# EAGLE design c12880ma (EAGLE 9.6.2)
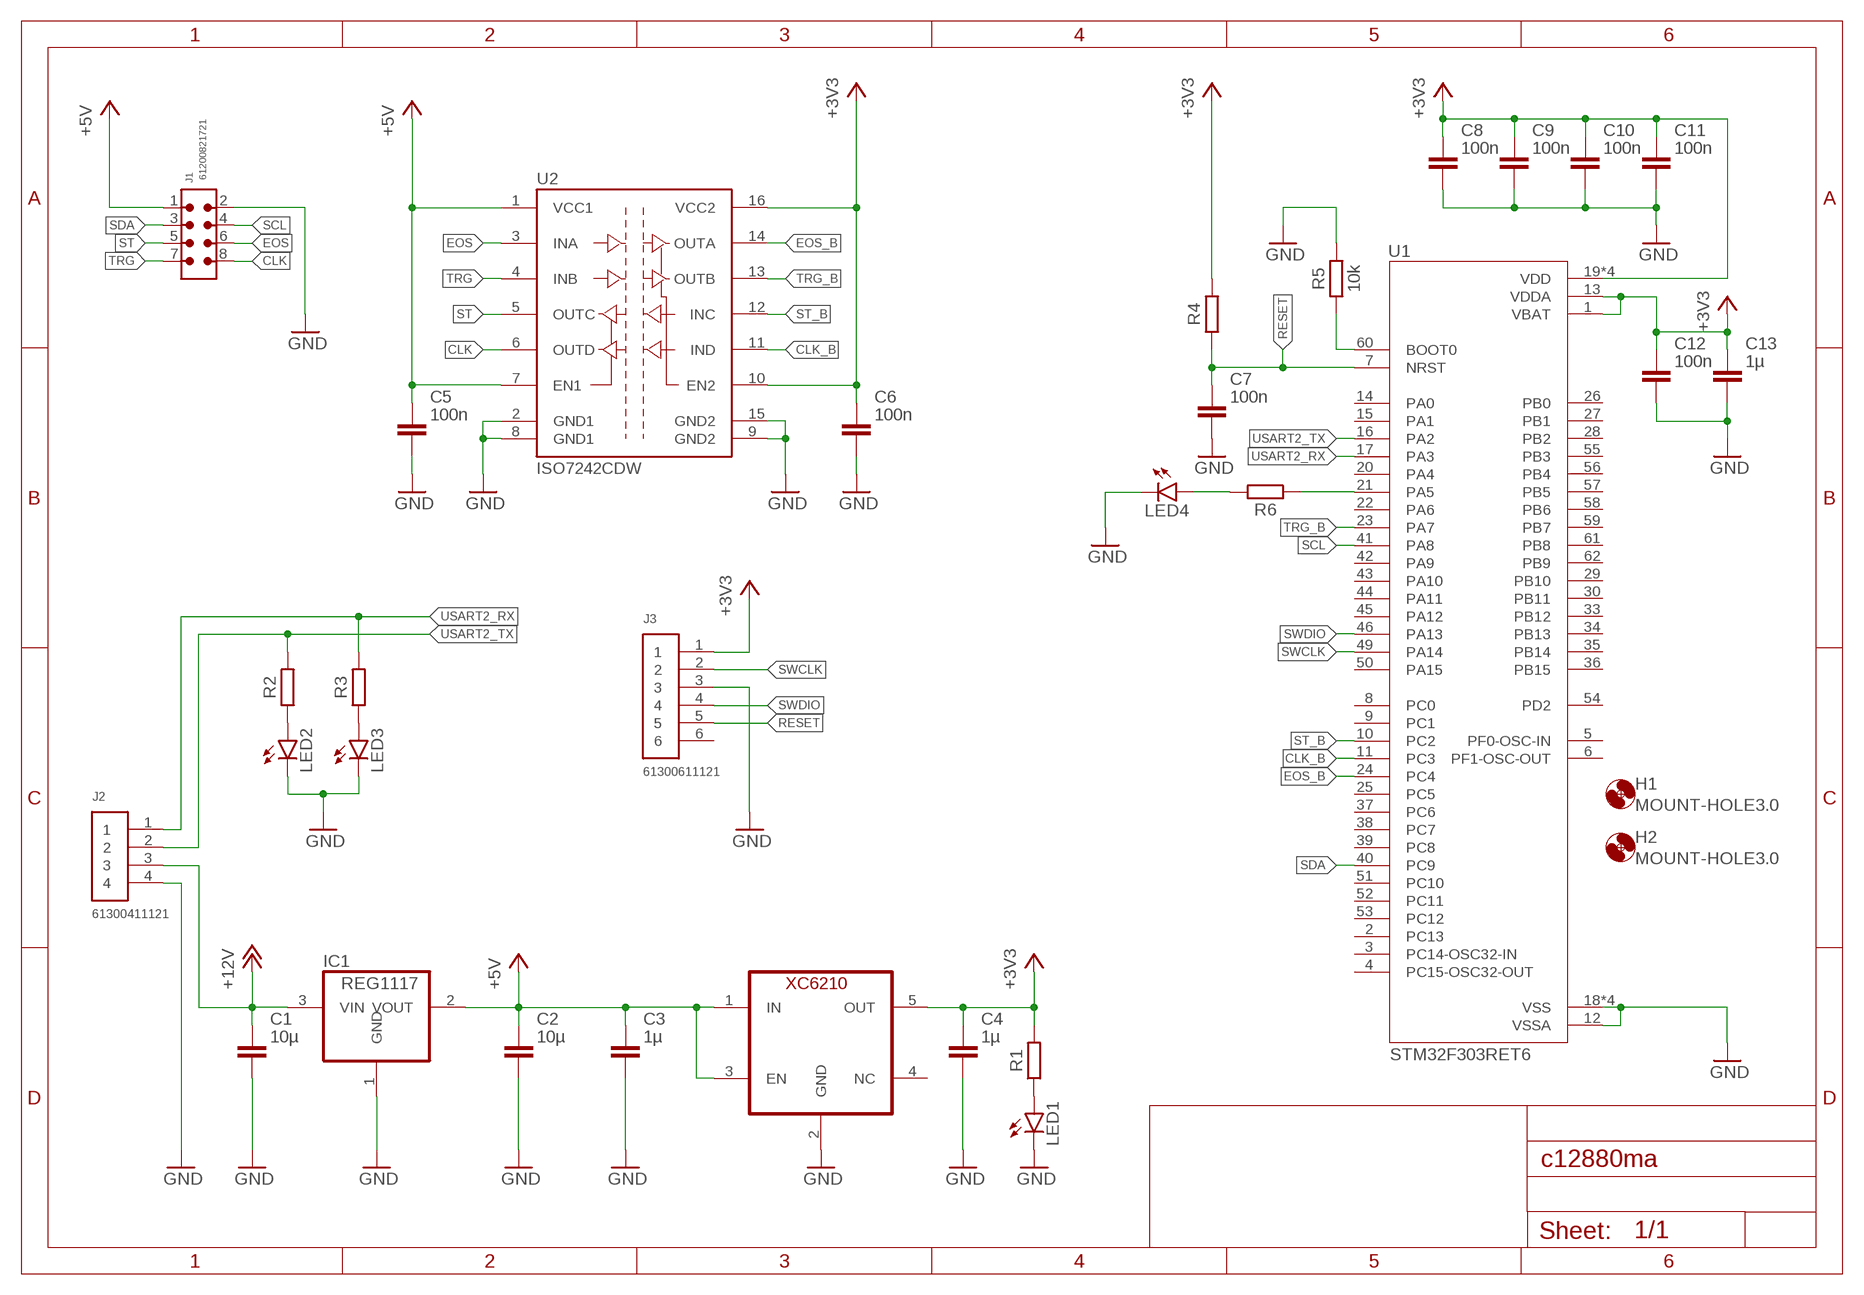
[diagram p0: schematic, sheet 1]

## Parts
C1  10µ  C_CHIP-0603(1608-METRIC)  [CAPC1608X85]
C2  10µ  C_CHIP-0603(1608-METRIC)  [CAPC1608X85]
C3  1µ  C_CHIP-0603(1608-METRIC)  [CAPC1608X85]
C4  1µ  C_CHIP-0603(1608-METRIC)  [CAPC1608X85]
C5  100n  C_CHIP-0603(1608-METRIC)  [CAPC1608X85]
C6  100n  C_CHIP-0603(1608-METRIC)  [CAPC1608X85]
C7  100n  C_CHIP-0603(1608-METRIC)  [CAPC1608X85]
C8  100n  C_CHIP-0603(1608-METRIC)  [CAPC1608X85]
C9  100n  C_CHIP-0603(1608-METRIC)  [CAPC1608X85]
C10  100n  C_CHIP-0603(1608-METRIC)  [CAPC1608X85]
C11  100n  C_CHIP-0603(1608-METRIC)  [CAPC1608X85]
C12  100n  C_CHIP-0603(1608-METRIC)  [CAPC1608X85]
C13  1µ  C_CHIP-0603(1608-METRIC)  [CAPC1608X85]
H1  MOUNT-HOLE3.0  [3,0]
H2  MOUNT-HOLE3.0  [3,0]
IC1  REG1117  [SOT223]
J1  61200821721  6120XX21721_61200821721  [61200821721]
J2  61300411121  [61300411121]
J3  61300611121  [61300611121]
LED1  LEDCHIP-LED0603  [CHIP-LED0603]
LED2  LEDCHIP-LED0603  [CHIP-LED0603]
LED3  LEDCHIP-LED0603  [CHIP-LED0603]
LED4  LEDCHIP-LED0603  [CHIP-LED0603]
R1  R_CHIP-0603(1608-METRIC)  [RESC1608X60]
R2  R_CHIP-0603(1608-METRIC)  [RESC1608X60]
R3  R_CHIP-0603(1608-METRIC)  [RESC1608X60]
R4  R_CHIP-0603(1608-METRIC)  [RESC1608X60]
R5  10k  R_CHIP-0603(1608-METRIC)  [RESC1608X60]
R6  R_CHIP-0603(1608-METRIC)  [RESC1608X60]
U1  STM32F303RET6  [QFP50P1200X1200X160-64N]
U2  ISO7242CDW  [SO-16DW]
U$1  XC6210  [SOT23-5]

## Nets
+3V3: C4.1 C6.1 C8.1 C9.1 C10.1 C11.1 C12.1 C13.1 J3.1 R1.2 R4.2 U1.1(VBAT) U1.13(VDDA) U1.19(VDD) U1.32(VDD) U1.48(VDD) U1.64(VDD) U2.10(EN2) U2.16(VCC2) U$1.5(OUT)
+5V: C2.1 C3.1 C5.1 IC1.2(VOUT) J1.1 U2.1(VCC1) U2.7(EN1) U$1.1(IN) U$1.3(EN)
+12V: C1.1 IC1.3(VIN) J2.3
CLK: J1.8 U2.6(OUTD)
CLK_B: U1.11(PC3) U2.11(IND)
EOS: J1.6 U2.3(INA)
EOS_B: U1.24(PC4) U2.14(OUTA)
GND: C1.2 C2.2 C3.2 C4.2 C5.2 C6.2 C7.2 C8.2 C9.2 C10.2 C11.2 C12.2 C13.2 IC1.1(GND) J1.2 J2.4 J3.3 LED1.C LED2.C LED3.C LED4.C R5.2 U1.12(VSSA) U1.18(VSS) U1.31(VSS) U1.47(VSS) U1.63(VSS) U2.2(GND1) U2.8(GND1) U2.9(GND2) U2.15(GND2) U$1.2(GND)
N$3: LED2.A R2.1
N$4: LED1.A R1.1
N$5: LED3.A R3.1
N$8: R5.1 U1.60(BOOT0)
N$9: R6.1 U1.21(PA5)
N$10: LED4.A R6.2
RESET: C7.1 J3.5 R4.1 U1.7(NRST)
SCL: J1.4 U1.41(PA8)
SDA: J1.3 U1.40(PC9)
ST: J1.5 U2.5(OUTC)
ST_B: U1.10(PC2) U2.12(INC)
SWCLK: J3.2 U1.49(PA14)
SWDIO: J3.4 U1.46(PA13)
TRG: J1.7 U2.4(INB)
TRG_B: U1.23(PA7) U2.13(OUTB)
USART2_RX: J2.1 R3.2 U1.17(PA3)
USART2_TX: J2.2 R2.2 U1.16(PA2)
Unconnected: J3.6 U1.2(PC13) U1.3(PC14-OSC32-IN) U1.4(PC15-OSC32-OUT) U1.5(PF0-OSC-IN) U1.6(PF1-OSC-OUT) U1.8(PC0) U1.9(PC1) U1.14(PA0) U1.15(PA1) U1.20(PA4) U1.22(PA6) U1.25(PC5) U1.26(PB0) U1.27(PB1) U1.28(PB2) U1.29(PB10) U1.30(PB11) U1.33(PB12) U1.34(PB13) U1.35(PB14) U1.36(PB15) U1.37(PC6) U1.38(PC7) U1.39(PC8) U1.42(PA9) U1.43(PA10) U1.44(PA11) U1.45(PA12) U1.50(PA15) U1.51(PC10) U1.52(PC11) U1.53(PC12) U1.54(PD2) U1.55(PB3) U1.56(PB4) U1.57(PB5) U1.58(PB6) U1.59(PB7) U1.61(PB8) U1.62(PB9) U$1.4(NC)

## Library data of the parts
C1-C13 = Capacitor:C: Capacitor - Generic; CATEGORY: Capacitor
H1 H2 = holes:MOUNT-HOLE: MOUNTING HOLE with drill center marker
IC1 = burr-brown:REG1117: 800mA and 1A Low Dropout (LDO) Positive Regulator 1.8V, 2.5V, 2.85V, 3.3V, 5V, and Adj; MPN: REG1117; OC_FARNELL: 1097566; OC_NEWARK: 14P6981
J1 = Wurth_Connectors_WR-BHD:6120XX21721_61200821721: WR-BHD 2.54 mm Male Angled Box Header KIND PROPERTIES: Pitch 2.54 mm Gender:Male MATERIAL PROPERTIES: Insulator Material:PBT Insulator Flammability Rating UL94 V-0 Insulator Color:Black Contact Material :Copper Alloy Contact Plating :Gold Contact Type: Stamped GENERAL INFORMATION: Operating Temperature:-40 °C up to +125 °C Compliance:RoHS Working Voltage: 250 V (AC) Withstanding Voltage:500 V (AC) Contact Resistance: 20 mΩ Insulation Resistance:1000 MΩ CERTIFICATION: UL Approval:E323964 PACKAGING PROPERTIES Packaging :Tray <https://www.we-online.de/katalog/media/o32888v209%20Family_WR-BHD_6120xx21721.jpg> Details see: https://www.we-online.de/katalog/en/em/BHD_2_54_MALE_ANGLED_BOX_HEADER_6120XX21721 Updated by Yingchun,Shan 2019-10-29 2019 (C) Würth Elektronik; CONTACT-RESISTANCE: 20mOhm; DATASHEET-URL: https://www.we-online.com/redexpert/spec/61200821721?ae; GENDER: Male; IR: 3A; LENGTH: 17.82mm; MOUNT: THT; PACKAGING: Tray; PART-NUMBER: 61200821721; PINS: 8; PITCH: 2.54mm; TYPE: Angled; WORKING-VOLTAGE: 250V(AC)
J2 = Headers:61300411121: CONN HEADER VERT 4POS 2.54MM Manufacturer's datasheet <https://katalog.we-online.de/em/datasheet/6130xx11121.pdf>; CREATED_BY: PCBLayout.com; DIGI_KEY_PART_NUMBER: 732-5317-ND; MANUFACTURER: Wurth Electronics Inc.; MPN: 61300411121
J3 = Headers:61300611121: CONN HEADER VERT 6POS 2.54MM Manufacturer's datasheet <https://katalog.we-online.de/em/datasheet/6130xx11121.pdf>; CREATED_BY: PCBLayout.com; DIGI_KEY_PART_NUMBER: 732-5319-ND; MANUFACTURER: Wurth Electronics Inc.; MPN: 61300611121
LED1-LED4 = led:LED: LED OSRAM: - CHIPLED LG R971, LG N971, LY N971, LG Q971, LY Q971, LO R971, LY R971 LH N974, LH R974 LS Q976, LO Q976, LY Q976 LO Q996 - Hyper CHIPLED LW Q18S LB Q993, LB Q99A, LB R99A - SideLED LS A670, LO A670, LY A670, LG A670, LP A670 LB A673, LV A673, LT A673, LW A673 LH A674 LY A675 LS A676, LA A676, LO A676, LY A676, LW A676 LS A679, LY A679, LG A679 - Hyper Micro SIDELED® LS Y876, LA Y876, LO Y876, LY Y876 LT Y87S - SmartLED LW L88C, LW L88S LB L89C, LB L89S, LG L890 LS L89K, LO L89K, LY L89K LS L896, LA L896, LO L896, LY L896 - TOPLED LS T670, LO T670, LY T670, LG T670, LP T670 LSG T670, LSP T670, LSY T670, LOP T670, LYG T670 LG T671, LOG T671, LSG T671 LB T673, LV T673, LT T673, LW T673 LH T674 LS T676, LA T676, LO T676, LY T676, LB T676, LH T676, LSB T676, LW T676 LB T67C, LV T67C, LT T67C, LS T67K, LO T67K, LY T67K, LW E67C LS E67B, LA E67B, LO E67B, LY E67B, LB E67C, LV E67C, LT E67C LW T67C LS T679, LY T679, LG T679 LS T770, LO T770, LY T770, LG T770, LP T770 LB T773, LV T773, LT T773, LW T773 LH T774 LS E675, LA E675, LY E675, LS T675 LS T776, LA T776, LO T776, LY T776, LB T776 LHGB T686 LT T68C, LB T68C - Hyper Mini TOPLED® LB M676 - Mini TOPLED Santana® LG M470 LS M47K, LO M47K, LY M47K Source: http://www.osram.convergy.de LUXEON: - LUMILED® LXK2-PW12-R00, LXK2-PW12-S00, LXK2-PW14-U00, LXK2-PW14-V00 LXK2-PM12-R00, LXK2-PM12-S00, LXK2-PM14-U00 LXK2-PE12-Q00, LXK2-PE12-R00, LXK2-PE12-S00, LXK2-PE14-T00, LXK2-PE14-U00 LXK2-PB12-K00, LXK2-PB12-L00, LXK2-PB12-M00, LXK2-PB14-N00, LXK2-PB14-P00, LXK2-PB14-Q00 LXK2-PR12-L00, LXK2-PR12-M00, LXK2-PR14-Q00, LXK2-PR14-R00 LXK2-PD12-Q00, LXK2-PD12-R00, LXK2-PD12-S00 LXK2-PH12-R00, LXK2-PH12-S00 LXK2-PL12-P00, LXK2-PL12-Q00, LXK2-PL12-R00 Source: www.luxeon.com KINGBRIGHT: KA-3528ASYC Source: www.kingbright.com
R1-R6 = Resistor:R: Resistor Fixed - Generic; CATEGORY: Resistor; SUB-CATEGORY: Fixed
U1 = STM32F303RET6:STM32F303RET6: MCU 32-Bit STM32 ARM Cortex M4 RISC 512KB Flash 2.5V/3.3V 64-Pin LQFP Tray Check availability <https://pricing.snapeda.com/parts/STM32F303RET6/STMicroelectronics/view-part?ref=eda>; AVAILABILITY: In Stock; DESCRIPTION: ARM® Cortex®-M4 STM32F3 Microcontroller IC 32-Bit Single-Core 72MHz 512KB (512K x 8) FLASH 64-LQFP (10x10); MF: STMicroelectronics; MP: STM32F303RET6; PACKAGE: LQFP-64 STMicroelectronics; PRICE: None; PURCHASE-URL: https://pricing.snapeda.com/search/part/STM32F303RET6/?ref=eda
U2 = _hhn_AMC1100_ISO7240_ADS130:ISO7242*: ISO7242 High Speed Quad Digital Isolators Package: SOIC-16 300mil (TI-postfix "DW") ISO7240x: 4-channel with enable ISO7240xF: 4-channel with disable and fault-control ISO7241: 3+1 channel with enables ISO7242: 2+2 channel with enables x = '_' (Generic); 'C' (TTL input thresholds); 'M' (CMOS input thresholds) Author: Dipl.-Ing. FH Rainer Bayer Hochschule Heilbronn: http://www.hochschule-heilbronn.de/rainer.bayer <http://www.hs-heilbronn.de/rainer.bayer> – rainer.bayer@hs-heilbronn.de Ingenieurbüro ing-rb: http://www.ing-rb.de/ – eagle@ing-rb.de Dozent dozent-rb: http://www.dozent-rb.de/ – eagle@dozent-rb.de
U$1 = Components:XC6210

## Board
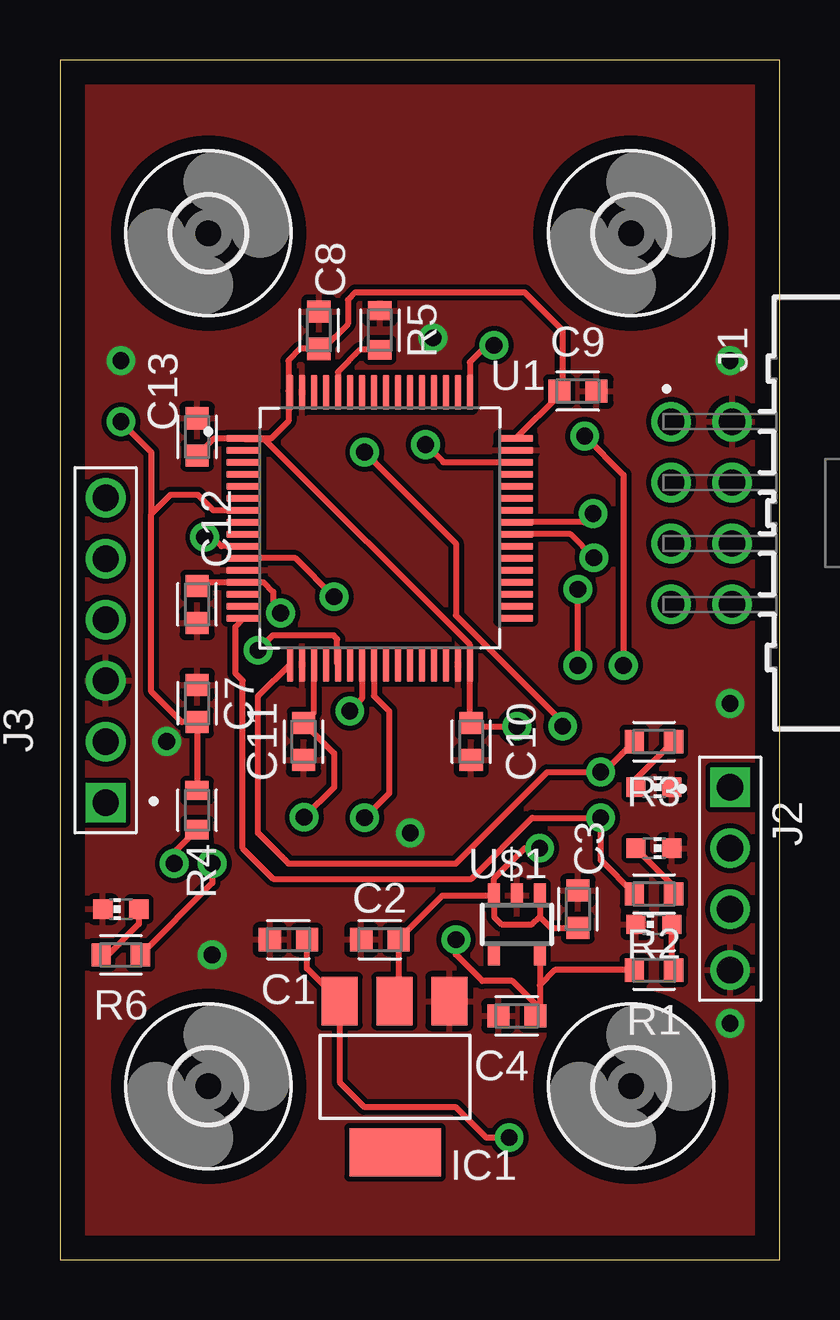
[diagram p1: board, top side]
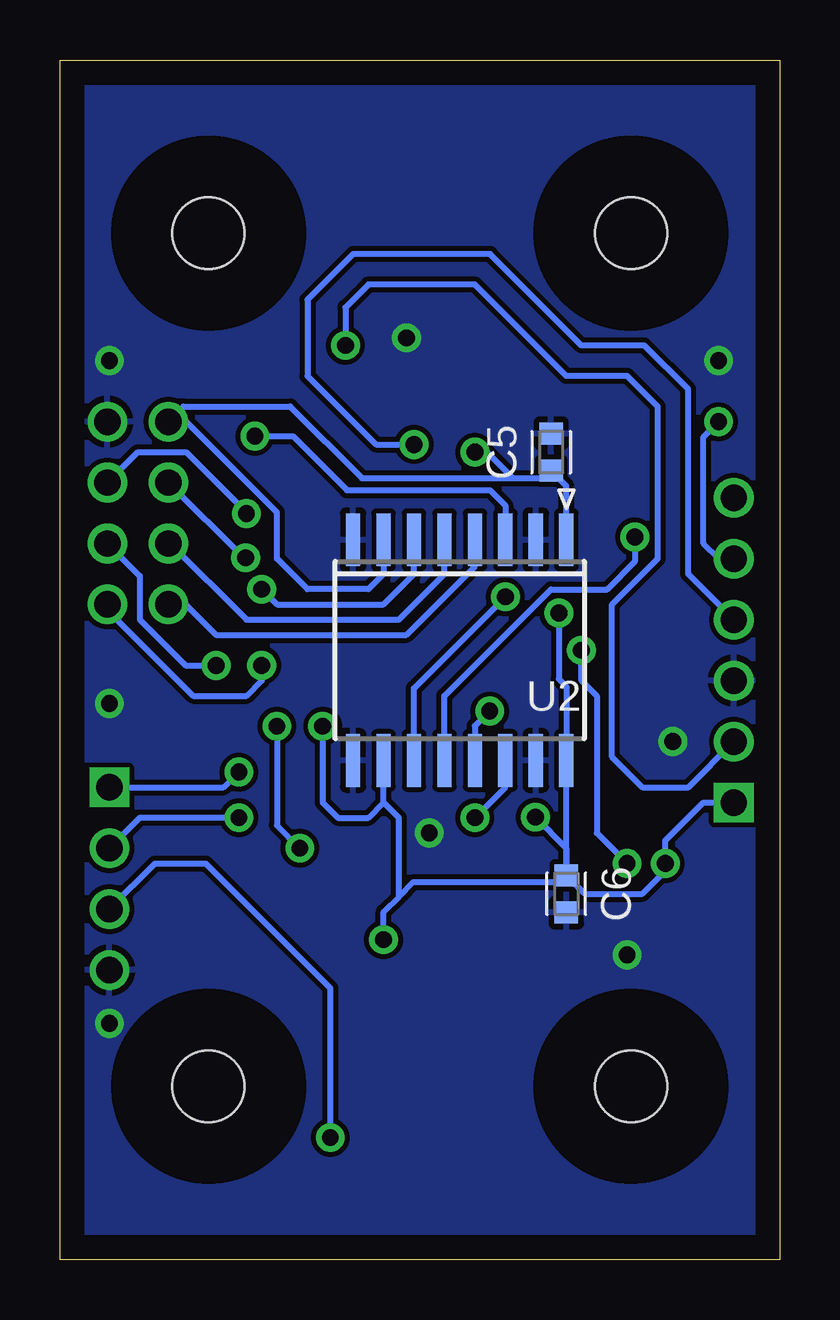
[diagram p2: board, bottom side, seen from below]

Size 30 x 50 mm. Coordinates in mm from the lower left corner, seen from the top.
Outline: 0,0 30,0 30,50 0,50 0,0
Copper layers (1*16): Top 0.035mm / dielectric 1.5mm / Bottom 0.035mm
Design rules "default *": minimum track width 6mil, minimum drill 0.35mm, track to track 8mil, track to pad 8mil, pad to pad 8mil, via to via 8mil, smd to smd 8mil, copper to edge 40mil, drill to drill 6mil, minimum pad ring 10mil, minimum via ring 8mil, stop-mask expansion 4mil, vias tented up to drill 0mil, thermal gap 10mil

### Footprints (pad centres in the part's own frame; a part is rotated, then mirrored left to right if it is on the bottom)
CAPC1608X85 = smd 0.921 x 0.97: 1 -0.775,0; 2 0.775,0
3,0 = hole 3: 0,0
SOT223 = smd 1.499 x 2.007: 1 -2.261,-3.15; 2 0.025,-3.15; 3 2.311,-3.15 | smd 3.81 x 2.007: 4 0,3.15
61200821721 = drill 1.1: 1 3.81,8.805; 2 3.81,6.265; 3 1.27,8.805; 4 1.27,6.265; 5 -1.27,8.805; 6 -1.27,6.265; 7 -3.81,8.805; 8 -3.81,6.265
61300411121 = drill 1.1 square: 1 -3.81,0 | drill 1.1: 2 -1.27,0; 3 1.27,0; 4 3.81,0
61300611121 = drill 1.1 square: 1 -6.35,0 | drill 1.1: 2 -3.81,0; 3 -1.27,0; 4 1.27,0; 5 3.81,0; 6 6.35,0
CHIP-LED0603 = smd 0.8 x 0.8: A 0,-0.75; C 0,0.75
RESC1608X60 = smd 0.799 x 0.974: 1 -0.815,0; 2 0.815,0
QFP50P1200X1200X160-64N = smd 1.47 x 0.28: 1 -5.67,3.75; 2 -5.67,3.25; 3 -5.67,2.75; 4 -5.67,2.25; 5 -5.67,1.75; 6 -5.67,1.25; 7 -5.67,0.75; 8 -5.67,0.25; 9 -5.67,-0.25; 10 -5.67,-0.75; 11 -5.67,-1.25; 12 -5.67,-1.75; 13 -5.67,-2.25; 14 -5.67,-2.75; 15 -5.67,-3.25; 16 -5.67,-3.75; 33 5.67,-3.75; 34 5.67,-3.25; 35 5.67,-2.75; 36 5.67,-2.25; 37 5.67,-1.75; 38 5.67,-1.25; 39 5.67,-0.75; 40 5.67,-0.25; 41 5.67,0.25; 42 5.67,0.75; 43 5.67,1.25; 44 5.67,1.75; 45 5.67,2.25; 46 5.67,2.75; 47 5.67,3.25; 48 5.67,3.75 | smd 0.28 x 1.47: 17 -3.75,-5.67; 18 -3.25,-5.67; 19 -2.75,-5.67; 20 -2.25,-5.67; 21 -1.75,-5.67; 22 -1.25,-5.67; 23 -0.75,-5.67; 24 -0.25,-5.67; 25 0.25,-5.67; 26 0.75,-5.67; 27 1.25,-5.67; 28 1.75,-5.67; 29 2.25,-5.67; 30 2.75,-5.67; 31 3.25,-5.67; 32 3.75,-5.67; 49 3.75,5.67; 50 3.25,5.67; 51 2.75,5.67; 52 2.25,5.67; 53 1.75,5.67; 54 1.25,5.67; 55 0.75,5.67; 56 0.25,5.67; 57 -0.25,5.67; 58 -0.75,5.67; 59 -1.25,5.67; 60 -1.75,5.67; 61 -2.25,5.67; 62 -2.75,5.67; 63 -3.25,5.67; 64 -3.75,5.67
SO-16DW = smd 0.6 x 2.2: 1 -4.445,-4.6; 2 -3.175,-4.6; 3 -1.905,-4.6; 4 -0.635,-4.6; 5 0.635,-4.6; 6 1.905,-4.6; 7 3.175,-4.6; 8 4.445,-4.6; 9 4.445,4.6; 10 3.175,4.6; 11 1.905,4.6; 12 0.635,4.6; 13 -0.635,4.6; 14 -1.905,4.6; 15 -3.175,4.6; 16 -4.445,4.6
SOT23-5 = smd 0.5 x 1: 1 -0.95,-1.2; 2 0,-1.2; 3 0.95,-1.2; 4 0.95,1.2; 5 -0.95,1.2

### Placement (x,y rotation side)
C1  9.53,13.34 180 top
C2  13.34,13.34 180 top
C3  21.59,14.61 90 top
C4  19.05,10.16 180 top
C5  9.53,33.66 90 bottom
C6  8.89,15.24 270 bottom
C7  5.71,23.18 90 top
C8  10.79,38.73 90 top
C9  21.59,36.2 0 top
C10  17.14,21.59 270 top
C11  10.16,21.59 270 top
C12  5.71,27.3 270 top
C13  5.71,34.29 90 top
H1  23.81,42.78 0 top
H2  23.81,7.22 0 top
H3  MOUNT-HOLE3.0  [3,0]  6.19,7.22 0 top
H4  MOUNT-HOLE3.0  [3,0]  6.19,42.78 0 top
IC1  13.97,7.62 180 top
J1  34.29,31.11 90 top
J2  27.94,15.88 270 top
J3  1.91,25.4 90 top
LED1  24.77,13.97 90 top
LED2  24.77,17.14 270 top
LED3  24.77,19.68 270 top
LED4  2.54,14.61 90 top
R1  24.77,12.06 180 top
R2  24.77,15.24 180 top
R3  24.77,21.59 180 top
R4  5.71,18.73 270 top
R5  13.34,38.73 90 top
R6  2.54,12.7 180 top
U1  13.34,30.48 0 top
U2  13.34,25.4 180 bottom
U$1  19.05,13.97 180 top

### Tracks (layer width: path | path; a pad name or v marks a point on that pad's centre or on a via)
+3V3  (via drill 0.7 pad 1.2)
  Top 0.254: C12.1 5.87,28.23 U1.13 8.49,28.23 8.89,27.83 8.89,27.26 v9.2,26.95 | 9.53,36.21 9.53,37.47 10.02,37.96 C8.1 10.96,37.96 12,39 12,40 12.32,40.32 19.37,40.32 20.95,38.73 20.95,36.34 C9.1 20.82,36.04 U1.48 | 9.53,36.21 9.53,34.94 8.81,34.23 U1.1 | 9.53,36.21 U1.64 | C13.1 6.43,34.23 U1.1 | U1.19 10.59,22.79 C11.1 11.43,21.09 11.43,19.68 v10.18,18.44 | U$1.5 20,11.43 | 20,11.43 20,10.34 C4.1 19.82,10.66 18.87,11.61 17.61,11.61 16.51,12.71 v16.51,13.34 | v19.05,22.23 17.29,22.23 C10.1 17.09,22.43 U1.32 17.09,25.63 8.52,34.2 7.7,34.2 U1.1 | R1.2 20.64,12.06 20,11.43 | R4.2 4.76,16.96 v4.76,16.51
  Bottom 0.254: C6.1 U2.16 8.89,23.89 9.2,24.2 v9.2,26.95 | v10.18,18.44 8.89,17.14 C6.1 | v19.05,22.23 19.05,19.05 18.41,18.41 17.14,18.41 16.51,19.05 | 16.51,19.05 U2.10 | v16.51,13.34 16.51,14.49 15.88,15.12 | 15.88,15.12 15.88,18.41 16.51,19.05 | C6.1 9.18,15.73 15.27,15.73 15.88,15.12 | J3.1 3.17,19.05 4.76,17.46 v4.76,16.51 4.76,16.19 5.71,15.24 8.12,15.24 C6.1
+5V  (via drill 0.7 pad 1.2)
  Top 0.254: v12.7,33.66 16.51,29.84 16.51,26.85 20.95,22.41 v20.95,22.23 | IC1.2 14.11,10.94 C2.1 15.95,15.17 U$1.3 | U$1.1 20,14.29 | C3.1 20.46,13.83 20,14.29 | U$1.3 18.1,14.29 18.41,13.97 19.68,13.97 20,14.29 | U$1.3 18.1,15.88 19.37,17.14 v20,17.14
  Bottom 0.254: U2.1 8.89,32.24 C5.1 9.84,32.56 11.11,32.56 | 11.11,32.56 17.41,32.56 20.41,35.56 24.85,35.56 J1.1 24.74,34.92 20.95,31.14 20.95,29.21 19.68,27.94 17.14,27.94 16.51,28.57 U2.7 | 11.11,32.56 12.21,33.66 v12.7,33.66 | v20.95,22.23 20.95,18.1 v20,17.14
+12V  (via drill 0.7 pad 1.2)
  Top 0.254: v18.73,5.08 17.78,5.08 16.51,6.35 12.7,6.35 11.66,7.39 IC1.3 10.3,12.13 C1.1
  Bottom 0.254: v18.73,5.08 18.73,11.32 23.92,16.51 26.04,16.51 J2.3
CLK  (via drill 0.7 pad 1.2)
  Top 0.254: v21.59,24.77 v21.59,27.94
  Bottom 0.254: v21.59,27.94 20.95,27.3 16.51,27.3 15.24,28.57 U2.6 | J1.8 28.02,27.07 24.45,23.5 22.23,23.5 21.59,24.13 v21.59,24.77
CLK_B  (via drill 0.7 pad 1.2)
  Top 0.254: v11.43,27.62 9.82,29.23 U1.11
  Bottom 0.254: U2.11 15.24,23.81 v11.43,27.62
EOS  (via drill 0.7 pad 1.2)
  Top 0.254: v21.88,34.32 23.5,32.7 v23.5,24.77
  Bottom 0.254: U2.3 11.43,31.43 12.06,32.07 18.04,32.07 20.29,34.32 v21.88,34.32 | J1.6 26.67,28.49 26.67,26.67 24.77,24.77 v23.5,24.77
EOS_B  (via drill 0.7 pad 1.2)
  Top 0.254: U1.24 13.09,23.5 13.72,22.86 13.72,19.43 v12.7,18.41
  Bottom 0.254: v12.7,18.41 11.43,19.68 U2.14
GND  (via drill 0.7 pad 1.2)
  other vias: 14.61,17.78 4.45,21.59 27.94,9.84 6.35,12.7 15.56,38.42 27.94,37.47 2.54,37.47 27.94,23.18
  pour Top: 0,50 30,50 30,0 0,0
  pour Bottom: 0,50 30,50 30,0 0,0
N$3
  Top 0.254: LED2.A 25.58,15.58 R2.1
N$4
  Top 0.254: R1.1 25.52,12.13 LED1.A
N$5
  Top 0.254: R3.1 24.02,20.02 LED3.A
N$8
  Top 0.254: R5.1 12.52,37.92 11.59,36.98 U1.60
N$9  (via drill 0.7 pad 1.2)
  Top 0.254: U1.21 11.55,24.84 11.55,25.86 11.41,26.01 8.87,26.01 v8.26,25.4 | v6.35,16.51 6.35,15.7 R6.1
  Bottom 0.254: v6.35,16.51 7.62,17.78 7.62,23.5 8.26,24.13 v8.26,25.4
N$10
  Top 0.254: LED4.A 3.29,13.99 2,12.7 R6.2
RESET  (via drill 0.7 pad 1.2)
  Top 0.254: R4.1 C7.1 5.08,22.4 3.81,23.67 3.81,31.08 | U1.7 6.39,31.23 5.76,31.86 4.59,31.86 3.81,31.08 | v2.54,34.92 3.81,33.66 3.81,31.08
  Bottom 0.254: J3.5 2.54,29.21 3.17,29.84 3.17,34.29 v2.54,34.92
SCL  (via drill 0.7 pad 1.2)
  Top 0.254: v22.23,31.1 21.86,30.73 U1.41
  Bottom 0.254: J1.4 26.75,33.66 24.75,33.66 22.23,31.13 v22.23,31.1
SDA  (via drill 0.7 pad 1.2)
  Top 0.254: v22.27,29.25 21.28,30.23 U1.40
  Bottom 0.254: J1.3 22.31,29.21 22.23,29.21 v22.27,29.25
ST
  Bottom 0.254: J1.5 25.4,29.84 22.23,26.67 15.88,26.67 13.97,28.57 U2.5
ST_B  (via drill 0.7 pad 1.2)
  Top 0.254: v6.03,30.11 6.35,30.11 6.74,29.73 U1.10
  Bottom 0.254: U2.12 13.97,23.5 9.53,27.93 7.18,27.93 6.03,29.09 v6.03,30.11
SWCLK  (via drill 0.7 pad 1.2)
  Top 0.254: v18.1,38.1 17.78,38.1 17.09,37.41 U1.49
  Bottom 0.254: J3.2 3.81,19.68 5.71,19.68 6.99,20.95 6.99,27.3 5.08,29.21 5.08,35.56 6.35,36.83 8.89,36.83 12.7,40.64 17.14,40.64 18.1,39.69 v18.1,38.1
SWDIO  (via drill 0.7 pad 1.2)
  Top 0.254: v15.24,33.97 15.98,33.23 U1.46
  Bottom 0.254: J3.4 3.81,28.57 3.81,36.27 5.64,38.1 8.26,38.1 12.06,41.91 17.78,41.91 19.68,40.01 19.68,36.83 16.83,33.97 v15.24,33.97
TRG
  Bottom 0.254: J1.7 24.77,27.3 23.5,26.04 15.56,26.04 12.7,28.89 U2.4
TRG_B  (via drill 0.7 pad 1.2)
  Top 0.254: U1.23 12.59,23.38 12.06,22.86 v12.08,22.86
  Bottom 0.254: v12.08,22.86 12.7,22.24 U2.13
USART2_RX  (via drill 0.7 pad 1.2)
  Top 0.254: U1.17 8.26,23.48 8.26,17.78 9.53,16.51 16.51,16.51 20.32,20.32 v22.54,20.32 22.68,20.32 R3.2
  Bottom 0.254: J2.1 23.18,19.68 v22.54,20.32
USART2_TX  (via drill 0.7 pad 1.2)
  Top 0.254: U1.16 7.3,26.37 7.3,24.45 7.62,24.13 7.62,17.14 8.89,15.88 17.16,15.88 19.68,18.4 19.68,18.41 v22.54,18.41 22.54,16.65 R2.2
  Bottom 0.254: v22.54,18.41 26.67,18.41 J2.2